# Altium schematic sheet shoot2.SchDoc
size A
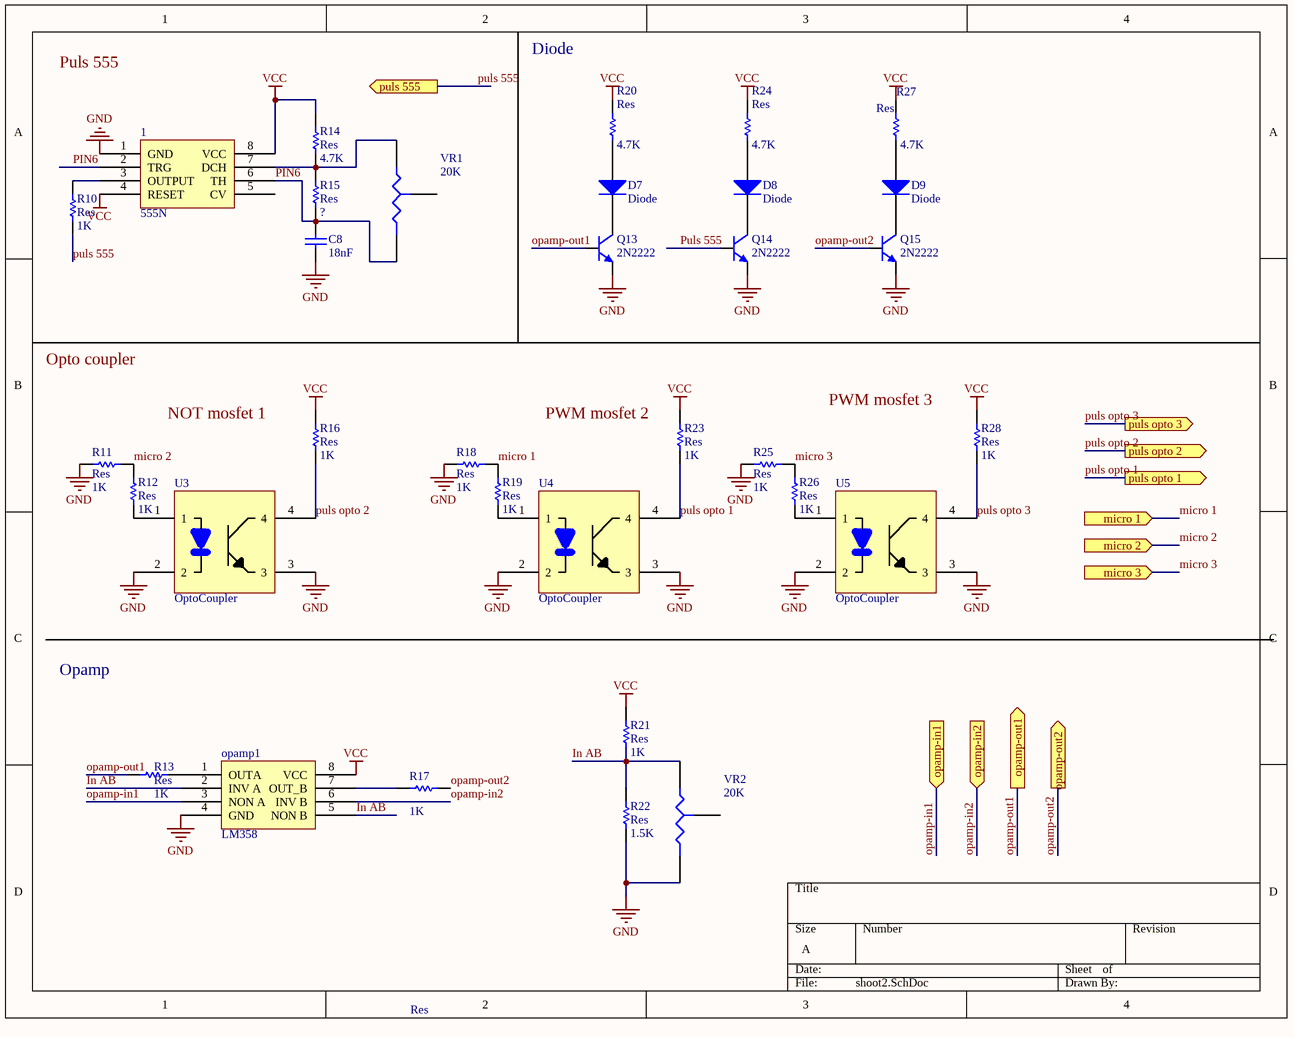
[diagram p0: shoot2.SchDoc]

## Parts
1  555N  [8 pin SOIC_N]
C8  value 18nF  [2012[0805]]  (hidden comment: Cap_UP)
D7  Diode  [2012[0805]]
D8  Diode  [2012[0805]]
D9  Diode  [2012[0805]]
opamp1  LM358  [8 pin SOIC_N]
Q13  2N2222  [SOT-23]
Q14  2N2222  [SOT-23]
Q15  2N2222  [SOT-23]
R10  Res  value 1K  [2012[0805]]
R11  Res  value 1K  [2012[0805]]
R12  Res  value 1K  [2012[0805]]
R13  Res  value 1K  [2012[0805]]
R14  Res  value 4.7K  [2012[0805]]
R15  Res  [2012[0805]]
R16  Res  value 1K  [2012[0805]]
R17  Res  value 1K  [2012[0805]]
R18  Res  value 1K  [2012[0805]]
R19  Res  value 1K  [2012[0805]]
R20  Res  value 4.7K  [2012[0805]]
R21  Res  value 1K  [2012[0805]]
R22  Res  value 1.5K  [2012[0805]]
R23  Res  value 1K  [2012[0805]]
R24  Res  value 4.7K  [2012[0805]]
R25  Res  value 1K  [2012[0805]]
R26  Res  value 1K  [2012[0805]]
R27  Res  value 4.7K  [2012[0805]]
R28  Res  value 1K  [2012[0805]]
U3  OptoCoupler  [DIP-4]
U4  OptoCoupler  [DIP-4]
U5  OptoCoupler  [DIP-4]
VR1  value 20K  [MULTITURN]  (hidden comment: Res Tap)
VR2  value 20K  [MULTITURN]  (hidden comment: Res Tap)

## Ports
micro 1 (in), micro 2 (in), micro 3 (in), opamp-in1 (in), opamp-in2 (in), opamp-out1 (out), opamp-out2 (out), puls 555 (out), puls opto 1 (out), puls opto 2 (out), puls opto 3 (out)

## Nets
GND: 1.1(GND) C8.2 opamp1.4(GND) Q13.3(E) Q14.3(E) Q15.3(E) R11.2 R18.2 R22.1 R25.2 U3.2 U3.3 U4.2 U4.3 U5.2 U5.3 VR2.2(B)
VCC: 1.4(RESET) 1.8(VCC) opamp1.8(VCC) R14.2 R16.2 R20.2 R21.2 R23.2 R24.2 R27.2 R28.2
In AB: opamp1.2(INV_A) opamp1.5(NON_B) R21.1 R22.2 VR2.1(A)
micro 1: R18.1 R19.2 ; port micro 1
micro 2: R11.1 R12.2 ; port micro 2
micro 3: R25.1 R26.2 ; port micro 3
opamp-in1: opamp1.3(NON_A) ; port opamp-in1
opamp-in2: opamp1.6(INV_B) ; port opamp-in2
opamp-out1: Q13.2(B) R13.2 ; port opamp-out1
opamp-out2: Q15.2(B) R17.1 ; port opamp-out2
PIN6: 1.2(TRG) 1.6(TH) C8.1 R15.1 VR1.2(B)
puls 555: Q14.2(B) R10.1 ; port puls 555
puls opto 1: R23.1 U4.4 ; port puls opto 1
puls opto 2: R16.1 U3.4 ; port puls opto 2
puls opto 3: R28.1 U5.4 ; port puls opto 3
Net1_3: 1.3(OUTPUT) R10.2
Net1_7: 1.7(DCH) R14.1 R15.2 VR1.1(A)
NetD7_1: D7.1(A) R20.1
NetD7_2: D7.2(K) Q13.1(C)
NetD8_1: D8.1(A) R24.1
NetD8_2: D8.2(K) Q14.1(C)
NetD9_1: D9.1(A) R27.1
NetD9_2: D9.2(K) Q15.1(C)
Netopamp1_1: opamp1.1(OUTA) R13.1
Netopamp1_7: opamp1.7(OUT_B) R17.2
NetR12_1: R12.1 U3.1
NetR19_1: R19.1 U4.1
NetR26_1: R26.1 U5.1

Not connected (* = marked no-connect by the designer): 1 5(CV); VR1 3(TAP); VR2 3(TAP)

## Notes on the sheet
- Diode
- Opamp
- Labels drawn without touching a wire or pin: NOT mosfet 1, Opto coupler, Puls 555, PWM mosfet 2, PWM mosfet 3

## Library data of the parts
1 opamp1 = 7667: Dual MOSFET Driver
C8 = Cap_UP: Capacitor; Published: 8-Jun-2000; LatestRevisionDate: 17-Jul-2002; LatestRevisionNote: Re-released for DXP Platform.; PackageReference: RAD-0.3; Publisher: Altium Limited
D7-D9 = Diode: 1 Amp General Purpose Rectifier; Revision 1: 11-Jul-2000: SIM Model Added.; Revision 2: 17-Jul-2002: Re-released for DXP Platform.; Package Information: Latest Revision: Aug-1999; Code - JEDEC: DO-204-AL; Published: 8-Jun-2000; Datasheet: Latest Revision: 1998; Package Reference: DO-41; Publisher: Altium Limited
Q13-Q15 = 2N2222: NPN Bipolar Transistor; Published: 8-Jun-2000; LatestRevisionDate: 17-Jul-2002; LatestRevisionNote: Re-released for DXP Platform.; PackageReference: TO-226; Publisher: Altium Limited; Code_JEDEC: TO-226-AA
R10-R28 = Res: Semiconductor Resistor; Published: 8-Jun-2000; LatestRevisionDate: 17-Jul-2002; LatestRevisionNote: Re-released for DXP Platform.; PackageReference: AXIAL-0.5; Publisher: Altium Limited
  R15: Value: ?
U3-U5 = TLP521
VR1 VR2 = Res Tap: Tapped Resistor; Sim Note: Enter the Resistance value and the set point into parameter fields.; Set Position: 0.5; Published: 24-Mar-1999; LatestRevisionDate: 17-Jul-2002; LatestRevisionNote: Re-released for DXP Platform.; PackageReference: VR3; Publisher: Altium Limited